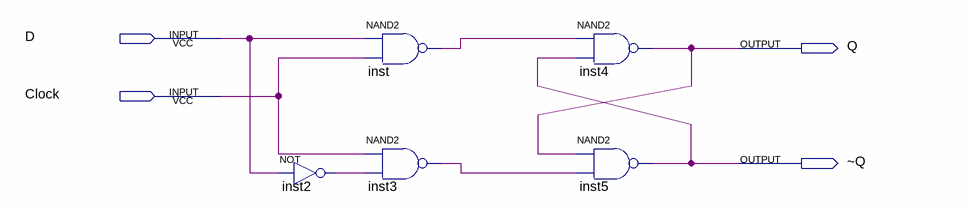
[diagram p0: schematic sheet]
// Quartus schematic lab9step2.bdf as structural Verilog: 5 symbols, 4 pins
module lab9step2 (
  input  D,
  input  Clock,
  output Q,
  output \~Q 
);

  wire inst2_out, inst3_out, inst_out;

  not inst2 (inst2_out, D);
  nand inst (inst_out, D, Clock);
  nand inst3 (inst3_out, Clock, inst2_out);
  nand inst4 (Q, inst_out, \~Q );
  nand inst5 (\~Q , Q, inst3_out);
endmodule
